# EAGLE design Ignition_Board (EAGLE 6.2)
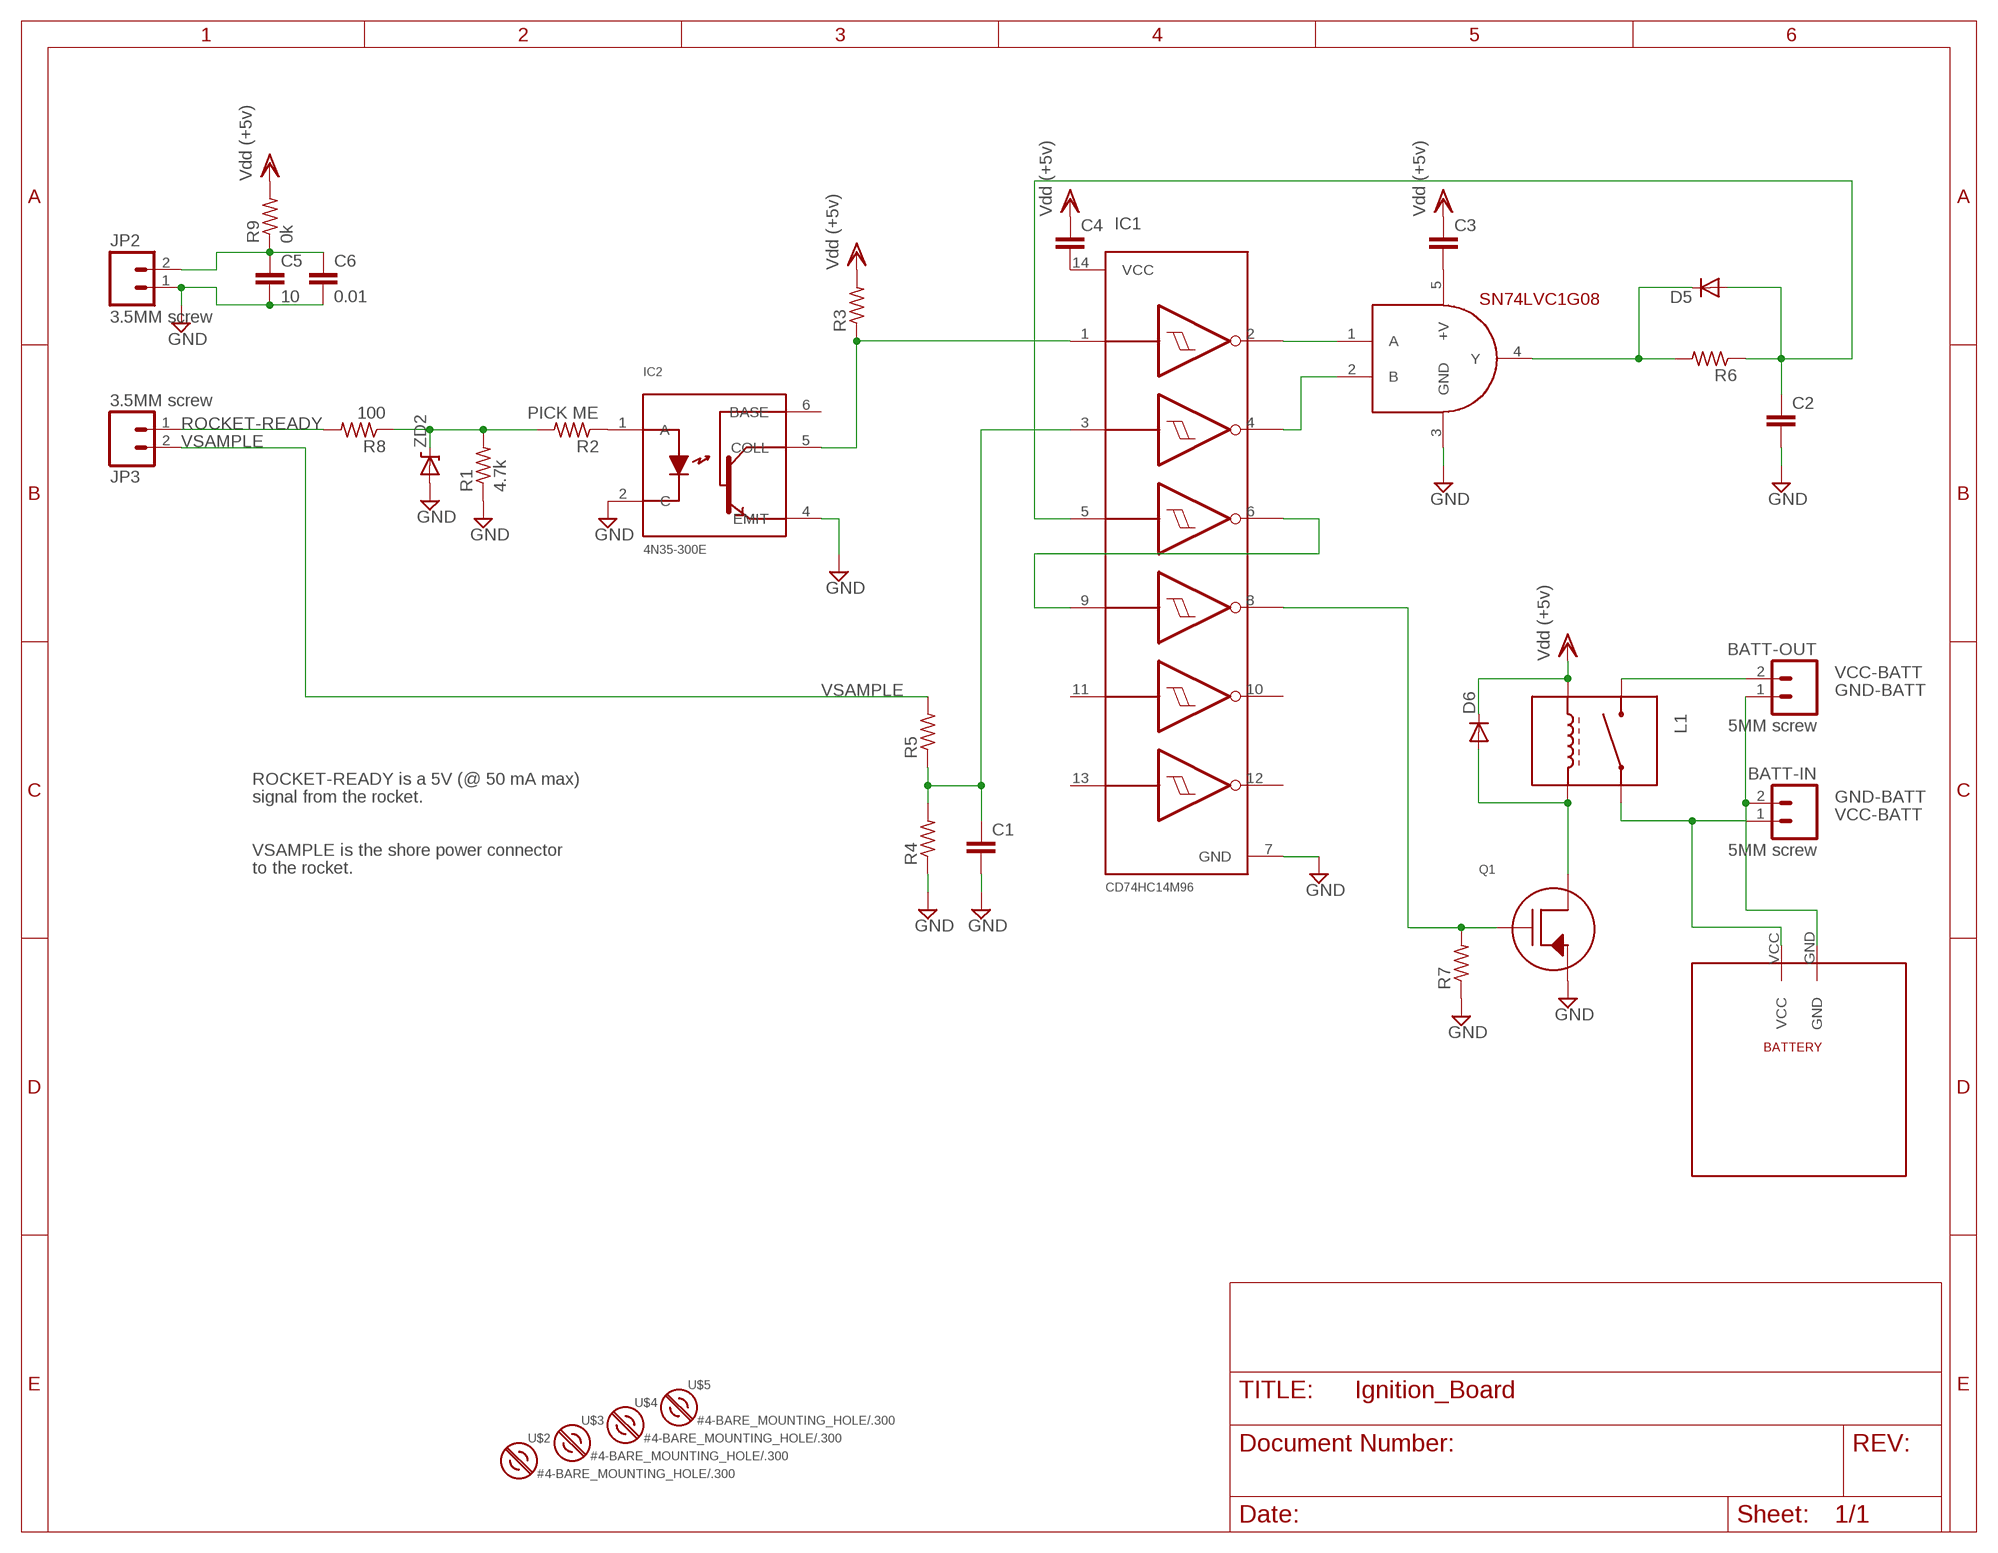
[diagram p0: schematic, sheet 1]

## Parts
BATT-IN  5MM screw  M025MM  [SCREWTERMINAL-5MM-2]
BATT-OUT  5MM screw  M025MM  [SCREWTERMINAL-5MM-2]
C1  C-EU0805-B-NOSILK  [0805-B-NOSILK]
C2  C-EU0805-B-NOSILK  [0805-B-NOSILK]
C3  C-EU0805-B-NOSILK  [0805-B-NOSILK]
C4  C-EU0805-B-NOSILK  [0805-B-NOSILK]
C5  10  C-EU0805-B-NOSILK  [0805-B-NOSILK]
C6  0.01  C-EU0805-B-NOSILK  [0805-B-NOSILK]
D5  DIODEPTH  [DIODE-1N4001]
D6  DIODEPTH  [DIODE-1N4001]
IC1  INVERT GATES  HEX_INV_SHMITT_TRIG  [INVERTSOIC14]
IC2  OPTOISOLATOR  [4N35-300E]
JP2  3.5MM screw  M023.5MM  [SCREWTERMINAL-3.5MM-2]
JP3  3.5MM screw  M023.5MM  [SCREWTERMINAL-3.5MM-2]
L1  RELAY  [G5T-1A]
Q1  NMOSFET  [FETSO-8]
R1  4.7k  R-US_0805-B-NOSILK  [0805-B-NOSILK]
R2  PICK ME  R-US_0805-B-NOSILK  [0805-B-NOSILK]
R3  R-US_0805-B-NOSILK  [0805-B-NOSILK]
R4  R-US_0805-B-NOSILK  [0805-B-NOSILK]
R5  R-US_0805-B-NOSILK  [0805-B-NOSILK]
R6  R-US_0805-B-NOSILK  [0805-B-NOSILK]
R7  R-US_0805-B-NOSILK  [0805-B-NOSILK]
R8  100  R-US_0805-B-NOSILK  [0805-B-NOSILK]
R9  0k  R-US_0805-B-NOSILK  [0805-B-NOSILK]
U$1  AND GATE  SN74LVC1G08  [SOT23-5]
U$2  #4-BARE_MOUNTING_HOLE/.300  [#4/.300-BARE+STD_NUT_OR_STAR_WASHER]
U$3  #4-BARE_MOUNTING_HOLE/.300  [#4/.300-BARE+STD_NUT_OR_STAR_WASHER]
U$4  #4-BARE_MOUNTING_HOLE/.300  [#4/.300-BARE+STD_NUT_OR_STAR_WASHER]
U$5  #4-BARE_MOUNTING_HOLE/.300  [#4/.300-BARE+STD_NUT_OR_STAR_WASHER]
U$6  BATTERY  [BATT-1]
ZD2  DIODE-ZENERPTH  [DIODE-ZENER]

## Nets
GND: C1.2 C2.2 C5.2 C6.2 IC1.7(GND) IC2.2(C) IC2.4(EMIT) JP2.1 Q1.1(SOURCE) R1.1 R4.1 R7.1 U$1.3(GND) ZD2.P$2(A)
GND-BATT: BATT-IN.2 BATT-OUT.1 U$6.GND
N$1: IC1.4(2Y) U$1.2(B)
N$3: IC1.1(1A) IC2.5(COLL) R3.1
N$4: JP3.1 R8.2
N$5: IC1.2(1Y) U$1.1(A)
N$6: IC2.1(A) R2.1
N$7: C1.1 IC1.3(2A) R4.2 R5.1
N$8: C4.2 IC1.14(VCC)
N$9: D6.A L1.CIN Q1.5(DRAIN)
N$10: IC1.8(4Y) Q1.4(GATE) R7.2
N$11: C3.2 U$1.5(+V)
N$12: C5.1 C6.1 JP2.2 R9.1
N$13: D5.C R6.2 U$1.4(Y)
N$15: C2.1 D5.A IC1.5(3A) R6.1
N-NOT2: IC1.6(3Y) IC1.9(4A)
ROCKET-READY: R1.2 R2.2 R8.1 ZD2.P$1(C)
VCC-BATT: BATT-IN.1 BATT-OUT.2 L1.SW1 L1.SW2 U$6.VCC
VDD: C3.1 C4.1 D6.C L1.COUT R3.2 R9.2 ; supply symbol labelled Vdd (+5v)
VSAMPLE: JP3.2 R5.2
Unconnected: IC1.10(5Y) IC1.11(5A) IC1.12(6Y) IC1.13(6A) IC2.6(BASE)

## Notes on the sheet
- ROCKET-READY is a 5V (@ 50 mA max)
- signal from the rocket.
- VSAMPLE is the shore power connector
- to the rocket.

## Library data of the parts
BATT-IN BATT-OUT JP2 JP3 = SparkFun:M02: Header 2 Standard 2-pin 0.1" header. Use with straight break away headers (SKU : PRT-00116), right angle break away headers (PRT-00553), swiss pins (PRT-00743), machine pins (PRT-00117), and female headers (PRT-00115). Molex polarized connector foot print use with SKU : PRT-08233 with associated crimp pins and housings.
C1-C6 = rcl_custom:C-EU: CAPACITOR, European symbol
D5 D6 = SparkFun:DIODE: Diode These are standard reverse protection diodes and small signal diodes. SMA package can handle up to about 1A. SOD-323 can handle about 200mA. What the SOD-323 package when ordering, there are some mfgs out there that are 5-pin packages.
IC1 = launch-tower:HEX_INV_SHMITT_TRIG: Single Schmitt-Trigger Inverter Gate
IC2 = launch-tower:OPTOISOLATOR
L1 = launch-tower:RELAY: FILTER pre-adjusted RF filter, type K, standard value E-12
Q1 = launch-tower:NMOSFET
R1-R9 = rcl_custom:R-US_: RESISTOR, American symbol
U$1 = SparkFun:SN74LVC1G08
U$2-U$5 = mount:#4-BARE_MOUNTING_HOLE: 1/8" drill hole for #4 screw mount
U$6 = launch-tower:BATTERY
ZD2 = SparkFun:DIODE-ZENER: Zener Diode Production Part - 8199 3.4V Zener Voltage

## Board
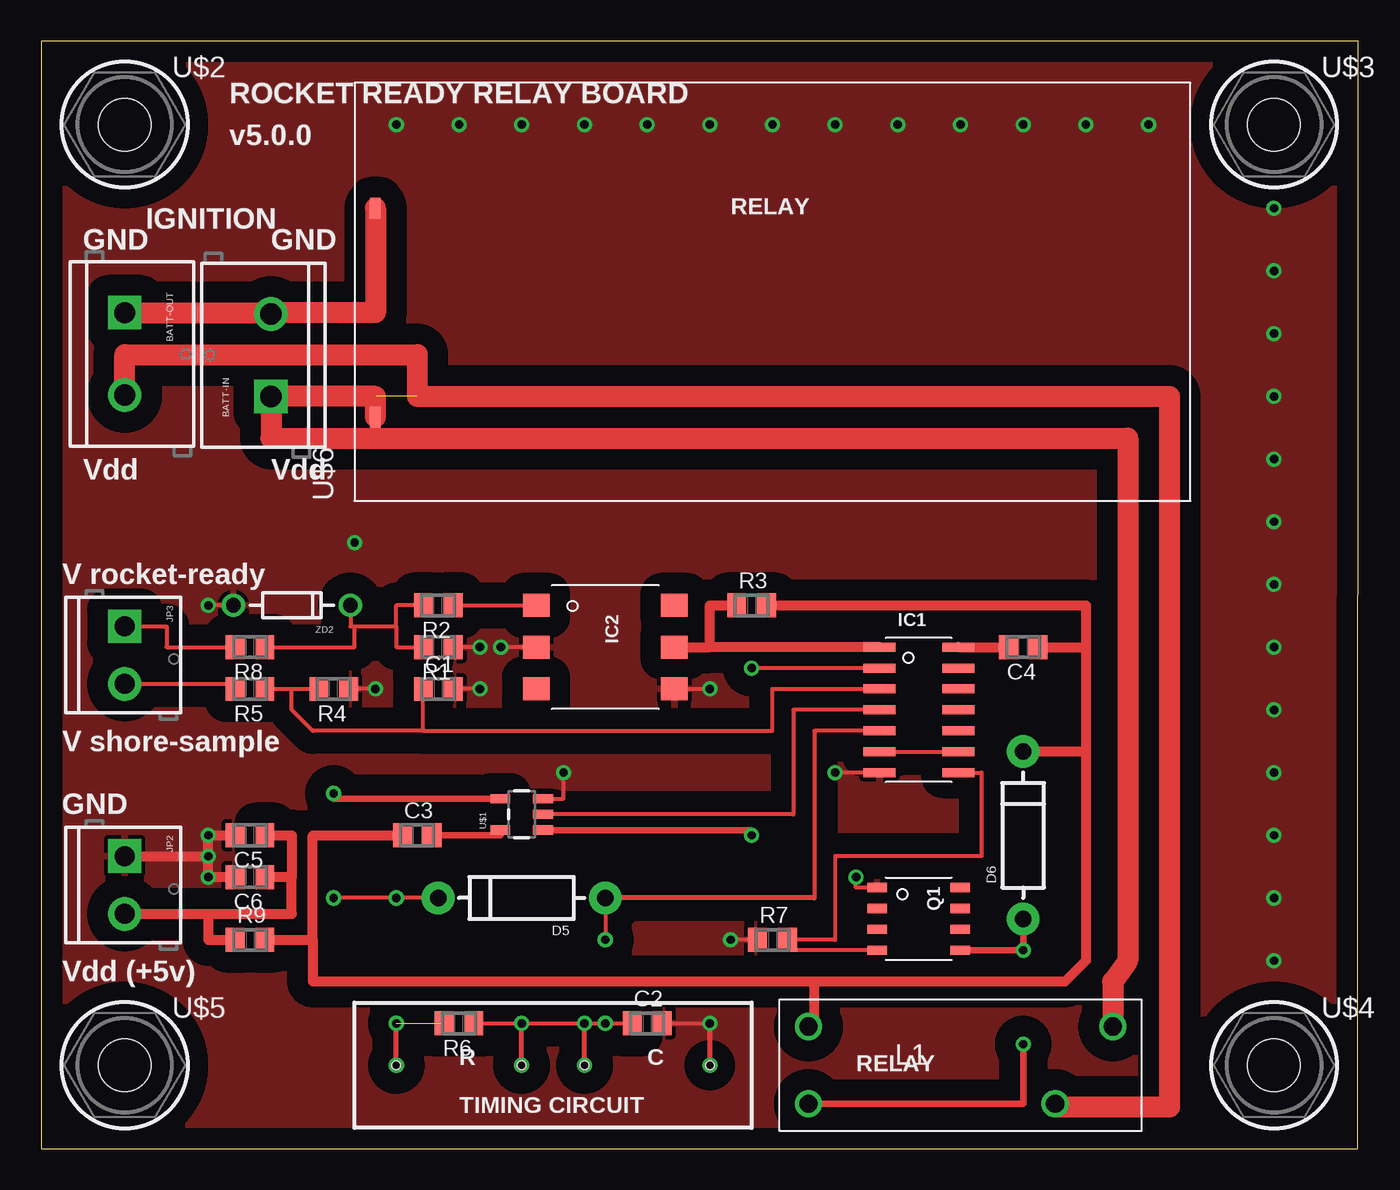
[diagram p1: board, top side]
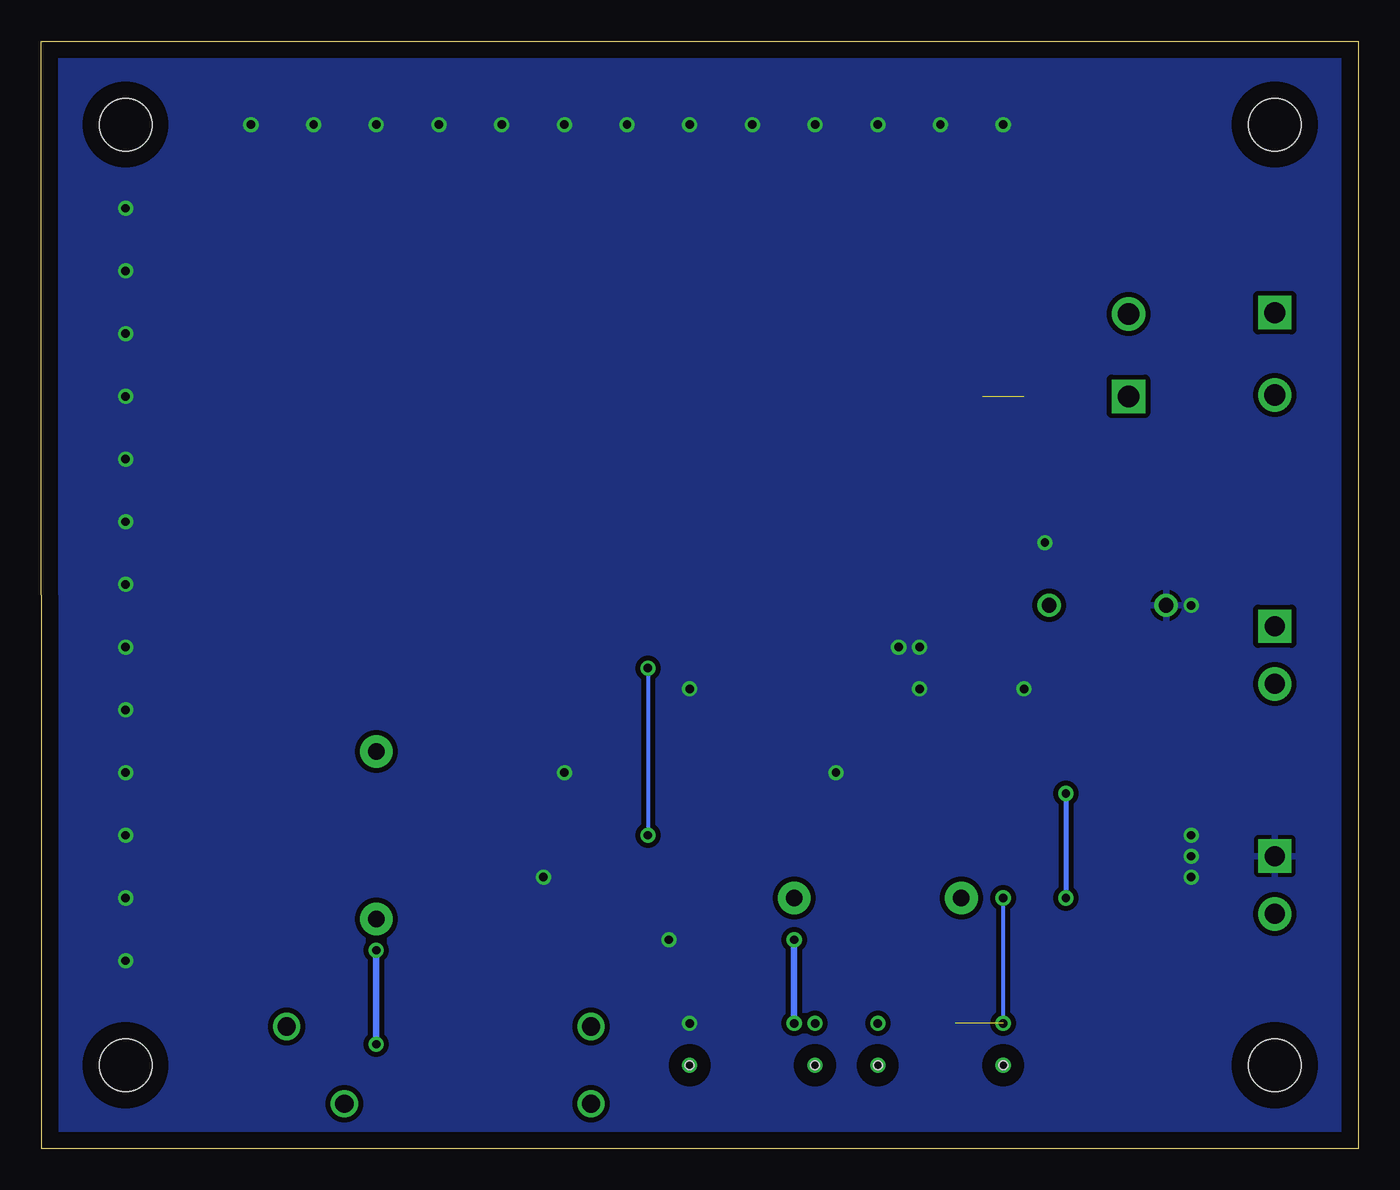
[diagram p2: board, bottom side, seen from below]

Size 80.06 x 67.3 mm. Coordinates in mm from the lower left corner, seen from the top.
Outline: 0,0 80.01,0 80.06,67.3 0,67.3 0,0
Copper layers (1*16): Top 0.035mm / dielectric 1.5mm / Bottom 0.035mm
Design rules: minimum track width 10mil, minimum drill 24mil, track to track 8mil, track to pad 8mil, pad to pad 8mil, via to via 8mil, smd to smd 8mil, copper to edge 40mil, drill to drill 8mil, minimum pad ring 10mil, minimum via ring 8mil, stop-mask expansion 4mil, vias tented up to drill 0mil, thermal gap 10mil
Holes 0.51 mm at 21.59,5.08 29.21,5.08 33.02,5.08 40.64,5.08

### Footprints (pad centres in the part's own frame; a part is rotated, then mirrored left to right if it is on the bottom)
SCREWTERMINAL-5MM-2 = drill 1.3 pad 2.032 square: 1 0,0 | drill 1.3 pad 2.032: 2 5,0
0805-B-NOSILK = smd 1.15 x 1.45: 1 -0.9,0; 2 0.9,0
DIODE-1N4001 = drill 1 pad 1.981: A -5.08,0; C 5.08,0
INVERTSOIC14 = smd 0.55 x 1.95: 1 -3.81,-2.4; 2 -2.54,-2.4; 3 -1.27,-2.4; 4 0,-2.4; 5 1.27,-2.4; 6 2.54,-2.4; 7 3.81,-2.4; 8 3.81,2.4; 9 2.54,2.4; 10 1.27,2.4; 11 0,2.4; 12 -1.27,2.4; 13 -2.54,2.4; 14 -3.81,2.4
4N35-300E = smd 1.4 x 1.6: 1 -2.54,-4.2; 2 0,-4.2; 3 2.54,-4.2; 4 2.54,4.2; 5 0,4.2; 6 -2.54,4.2
SCREWTERMINAL-3.5MM-2 = drill 1.2 pad 2.032 square: 1 0,0 | drill 1.2 pad 2.032: 2 3.5,0
G5T-1A = drill 1.1: CIN -9.25,-2.35; COUT -9.25,2.35; SW1 5.75,-2.35; SW2 9.25,2.35
FETSO-8 = smd 0.559 x 1.194: 1 -1.905,-2.527; 2 -0.635,-2.527; 3 0.635,-2.527; 4 1.905,-2.527; 5 1.905,2.527; 6 0.635,2.527; 7 -0.635,2.527; 8 -1.905,2.527
SOT23-5 = smd 0.55 x 1.2: 1 -0.95,-1.3; 2 0,-1.3; 3 0.95,-1.3; 4 0.95,1.3; 5 -0.95,1.3
#4/.300-BARE+STD_NUT_OR_STAR_WASHER = hole 3.175: 0,0
BATT-1 = smd 1.27 x 0.635: GND 5.08,24.13; VCC -7.62,24.13
DIODE-ZENER = drill 0.9: P$1 -3.556,0; P$2 3.556,0

### Placement (x,y rotation side)
BATT-IN  13.97,45.72 90 top
BATT-OUT  5.08,50.8 270 top
C1  24.13,27.94 0 top
C2  36.83,7.62 0 top
C3  22.86,19.05 0 top
C4  59.69,30.48 180 top
C5  12.7,19.05 180 top
C6  12.7,16.51 180 top
D5  29.21,15.24 180 top
D6  59.69,19.05 90 top
IC1  53.34,26.67 270 top
IC2  34.29,30.48 270 top
JP2  5.08,17.78 270 top
JP3  5.08,31.75 270 top
L1  55.88,5.08 0 top
Q1  53.34,13.97 270 top
R1  24.13,30.48 180 top
R2  24.13,33.02 180 top
R3  43.18,33.02 0 top
R4  17.78,27.94 180 top
R5  12.7,27.94 180 top
R6  25.4,7.62 180 top
R7  44.45,12.7 0 top
R8  12.7,30.48 180 top
R9  12.7,12.7 0 top
U$1  29.21,20.32 90 top
U$2  5.08,62.23 0 top
U$3  74.93,62.23 0 top
U$4  74.93,5.08 0 top
U$5  5.08,5.08 0 top
U$6  44.45,52.07 90 top
ZD2  15.24,33.02 180 top

### Tracks (layer width: path | path; a pad name or v marks a point on that pad's centre or on a via)
GND  (via drill 0.51)
  Top 0.254: v26.67,27.94 C1.2 | IC1.7 v48.26,22.86 | C2.2 v40.64,7.62 | IC2.4 v40.64,27.94 | U$1.3 31.75,21.27 v31.75,22.86 | Q1.1 49.53,15.88 v49.53,16.51 | R7.1 v41.91,12.7 | IC2.2 v27.94,30.48 | ZD2.P$2 v10.16,33.02 | v26.67,30.48 R1.1 | v20.32,27.94 R4.1
  Top 0.305: v40.64,5.08 v40.64,7.62
  Top 0.61: JP2.1 v10.16,17.78 | v10.16,17.78 v10.16,19.05 C5.2 | C6.2 v10.16,16.51 v10.16,17.78
  other vias: 19.05,36.83 74.93,53.34 74.93,49.53 74.93,45.72 74.93,41.91 74.93,38.1 74.93,34.29 74.93,30.48 74.93,26.67 74.93,22.86 74.93,19.05 74.93,15.24 74.93,11.43 74.93,57.15 67.31,62.23 63.5,62.23 59.69,62.23 55.88,62.23 52.07,62.23 48.26,62.23 44.45,62.23 40.64,62.23 36.83,62.23 33.02,62.23 29.21,62.23 25.4,62.23 21.59,62.23
  pour Top (isolate 1.27): 0,67.31 80.01,67.31 80.01,0 0,0
  pour Bottom (isolate 0.305): 0,67.31 80.01,67.31 80.01,0 0,0
GND-BATT
  Top 1.27: BATT-OUT.1 13.89,50.8 BATT-IN.2 14.05,50.8 20.32,50.8 U$6.GND
N$1
  Top 0.254: IC1.4 45.72,26.67 45.72,20.32 U$1.2
N$3
  Top 0.61: IC2.5 40.64,30.48 | 40.64,30.48 40.64,33.02 R3.1 | IC1.1 40.64,30.48
N$4
  Top 0.254: JP3.1 7.62,31.75 7.62,30.48 R8.2
N$5  (via drill 0.51)
  Top 0.254: IC1.2 v43.18,29.21
  Top 0.406: U$1.1 43.18,19.37 v43.18,19.05
  Bottom 0.254: v43.18,29.21 v43.18,19.05
N$6
  Top 0.254: R2.1 IC2.1
N$7
  Top 0.254: R5.1 15.24,27.94 | 15.24,27.94 R4.2 | 23.23,25.4 16.51,25.4 15.24,26.67 15.24,27.94 | 23.23,25.4 C1.1 | 23.23,25.4 44.45,25.4 44.45,27.94 IC1.3
N$8
  Top 0.61: IC1.14 C4.2
N$9  (via drill 0.51)
  Top 0.406: Q1.5 v59.69,12.06 D6.A | L1.CIN 59.69,2.73 v59.69,6.35
  Bottom 0.406: v59.69,6.35 v59.69,12.06
N$10
  Top 0.254: Q1.4 45.35,12.06 R7.2 48.26,12.7 48.26,17.78 57.15,17.78 57.15,22.86 IC1.8
N$11
  Top 0.406: C3.2 27.91,19.05 U$1.5
N$12
  Top 0.61: C5.1 15.24,19.05 15.24,16.51 | 15.24,16.51 C6.1 | JP2.2 10.16,14.28 | 10.16,14.28 10.16,12.7 R9.1 | 10.16,14.28 15.24,14.28 15.24,16.51
N$13  (via drill 0.51)  (1 unrouted)
  Top 0.254: D5.C v21.59,15.24 v17.78,15.24
  Top 0.305: v21.59,5.08 v21.59,7.62
  Top 0.406: U$1.4 17.78,21.27 v17.78,21.59
  Bottom 0.254: v21.59,7.62 v21.59,15.24
  Bottom 0.305: v17.78,21.59 v17.78,15.24
N$15  (via drill 0.51)
  Top 0.254: R6.1 v29.21,7.62 v33.02,7.62 v34.29,7.62 C2.1 | D5.A v34.29,12.7 | IC1.5 46.99,25.4 46.99,15.24
  Top 0.305: 46.99,15.24 D5.A | v29.21,5.08 v29.21,7.62 | v33.02,5.08 v33.02,7.62
  Bottom 0.406: v34.29,12.7 v34.29,7.62
N-NOT2
  Top 0.254: IC1.6 IC1.9
ROCKET-READY
  Top 0.254: ZD2.P$1 18.8,31.75 19.05,31.75 | R2.2 21.59,33.02 21.59,31.75 | 21.59,31.75 21.59,30.48 R1.2 | 19.05,31.75 21.59,31.75 | R8.1 19.05,30.48 19.05,31.75
VCC-BATT  (1 unrouted)
  Top 1.27: U$6.VCC 20.32,45.72 BATT-IN.1 13.97,43.18 66.04,43.18 66.04,11.43 65.13,10.16 L1.SW2 | BATT-OUT.2 5.08,48.26 22.86,48.26 22.86,45.72 68.58,45.72 68.58,2.54 61.63,2.54 L1.SW1
VDD
  Top 0.61: 16.51,12.7 16.51,10.16 46.99,10.16 | R3.2 63.5,33.02 63.5,30.48 | 63.5,30.48 63.5,24.13 | 63.5,24.13 63.5,11.43 62.23,10.16 46.99,10.16 | R9.2 16.51,12.7 | 63.5,24.13 D6.C | L1.COUT 46.99,7.43 46.99,10.16 | 16.51,12.7 16.51,19.05 C3.1 | C4.1 63.5,30.48
VSAMPLE
  Top 0.254: JP3.2 11.8,28.25 R5.2

### Text on the board
tPlace: ROCKET READY RELAY BOARD | v5.0.0 | RELAY | IGNITION | GND | GND | Vdd | Vdd | V rocket-ready | V shore-sample | GND | Vdd (+5v) | R | C | RELAY | TIMING CIRCUIT